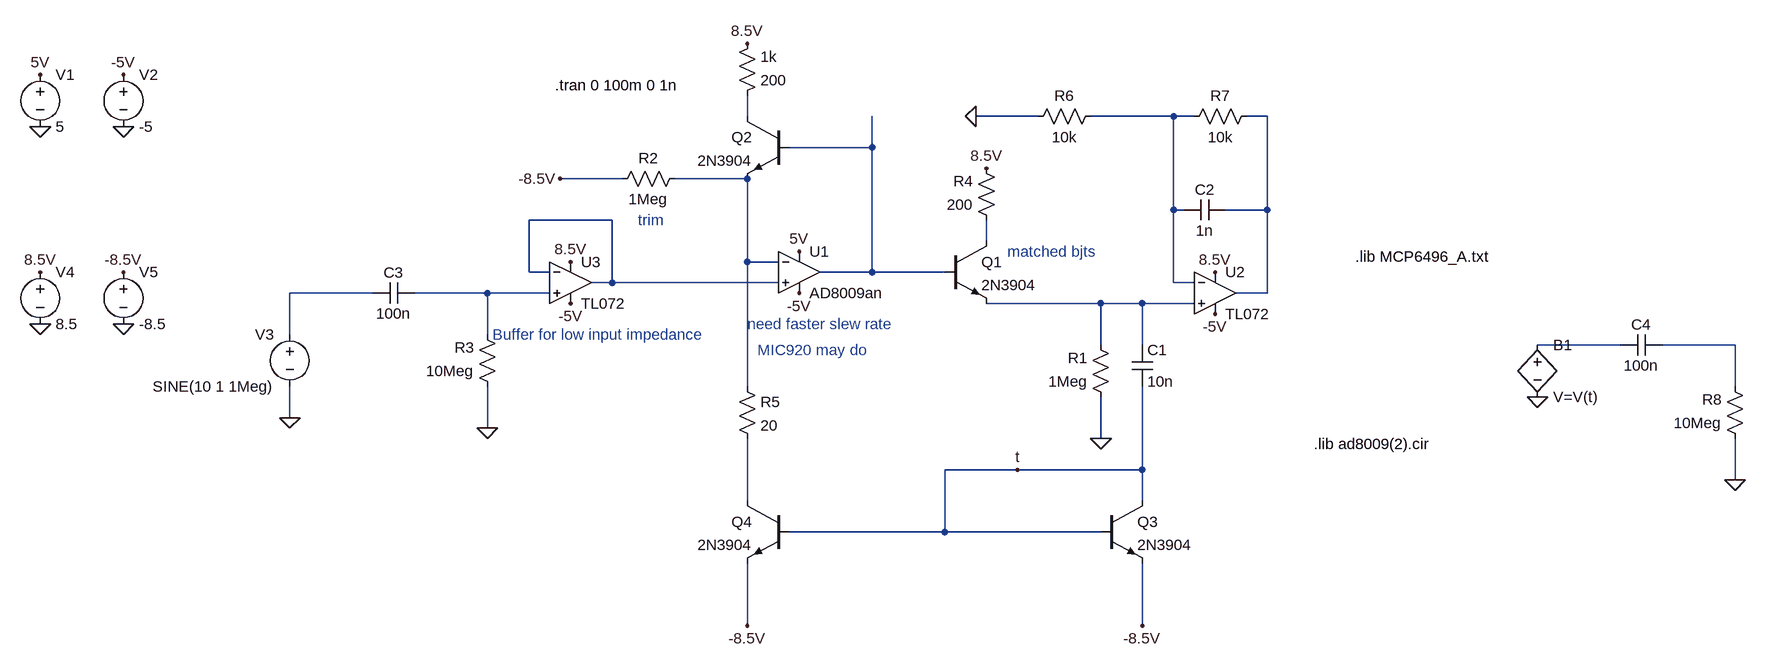
[diagram p0: schematic ogledalce.asc]
ogledalce.asc, the LTspice schematic file:
Version 4
SHEET 1 1620 924
WIRE 80 32 80 0
WIRE 528 32 432 32
WIRE 736 32 608 32
WIRE 768 32 736 32
WIRE 880 32 848 32
WIRE 272 80 272 32
WIRE 272 80 144 80
WIRE -112 128 -208 128
WIRE 80 128 -32 128
WIRE 736 176 736 32
WIRE 752 176 736 176
WIRE 880 176 880 32
WIRE 880 176 816 176
WIRE -128 192 -256 192
WIRE 448 224 448 192
WIRE 80 256 80 128
WIRE 128 256 80 256
WIRE -256 272 -256 192
WIRE -224 272 -256 272
WIRE 272 272 272 80
WIRE 272 272 192 272
WIRE 384 272 272 272
WIRE -128 288 -128 192
WIRE -128 288 -160 288
WIRE 128 288 -128 288
WIRE 736 288 736 176
WIRE 768 288 736 288
WIRE -496 304 -624 304
WIRE -320 304 -432 304
WIRE -224 304 -320 304
WIRE 880 304 880 176
WIRE 880 304 832 304
WIRE 624 320 448 320
WIRE 688 320 624 320
WIRE 768 320 688 320
WIRE -624 368 -624 304
WIRE -320 368 -320 304
WIRE 624 384 624 320
WIRE 688 384 688 320
WIRE 1424 384 1296 384
WIRE 1600 384 1488 384
WIRE 80 448 80 256
WIRE 1600 448 1600 384
WIRE -624 496 -624 448
WIRE -320 512 -320 448
WIRE 624 528 624 464
WIRE 496 576 384 576
WIRE 688 576 688 448
WIRE 688 576 496 576
WIRE 1600 592 1600 528
WIRE 80 624 80 528
WIRE 688 624 688 576
WIRE 384 672 384 576
WIRE 384 672 144 672
WIRE 624 672 384 672
WIRE 80 816 80 720
WIRE 688 816 688 720
FLAG -1008 48 0
FLAG 160 240 5V
FLAG -1008 -32 5V
FLAG -880 48 0
FLAG -880 -32 -5V
FLAG 160 304 -5V
FLAG 624 528 0
FLAG -624 496 0
FLAG 800 272 8.5V
FLAG 800 336 -5V
FLAG -1008 352 0
FLAG -1008 272 8.5V
FLAG -880 352 0
FLAG -880 272 -8.5V
FLAG 448 112 8.5V
FLAG 80 -80 8.5V
FLAG -208 128 -8.5V
FLAG 432 32 0
FLAG -320 512 0
FLAG -192 256 8.5V
FLAG -192 320 -5V
FLAG 80 816 -8.5V
FLAG 688 816 -8.5V
FLAG 496 576 t
FLAG 1600 592 0
FLAG 1296 464 0
SYMBOL voltage -1008 -48 R0
WINDOW 123 0 0 Left 0
WINDOW 39 0 0 Left 0
SYMATTR InstName V1
SYMATTR Value 5
SYMBOL voltage -880 -48 R0
WINDOW 123 0 0 Left 0
WINDOW 39 0 0 Left 0
SYMATTR InstName V2
SYMATTR Value -5
SYMBOL res 640 480 R180
WINDOW 0 36 76 Left 2
WINDOW 3 36 40 Left 2
SYMATTR InstName R1
SYMATTR Value 1Meg
SYMBOL cap 672 384 R0
SYMATTR InstName C1
SYMATTR Value 10n
SYMBOL voltage -624 352 M0
WINDOW 123 0 0 Left 0
WINDOW 39 0 0 Left 0
SYMATTR InstName V3
SYMATTR Value SINE(10 1 1Meg)
SYMBOL npn 384 224 R0
SYMATTR InstName Q1
SYMATTR Value 2N3904
SYMBOL voltage -1008 256 R0
WINDOW 123 0 0 Left 0
WINDOW 39 0 0 Left 0
SYMATTR InstName V4
SYMATTR Value 8.5
SYMBOL voltage -880 256 R0
WINDOW 123 0 0 Left 0
WINDOW 39 0 0 Left 0
SYMATTR InstName V5
SYMATTR Value -8.5
SYMBOL res 464 208 R180
WINDOW 0 36 76 Left 2
WINDOW 3 36 40 Left 2
SYMATTR InstName R4
SYMATTR Value 200
SYMBOL npn 144 32 M0
SYMATTR InstName Q2
SYMATTR Value 2N3904
SYMBOL res 64 16 M180
WINDOW 0 36 76 Left 2
WINDOW 3 36 40 Left 2
SYMATTR InstName 1k
SYMATTR Value 200
SYMBOL res -16 112 R90
WINDOW 0 0 56 VBottom 2
WINDOW 3 32 56 VTop 2
SYMATTR InstName R2
SYMATTR Value 1Meg
SYMBOL res 624 16 R90
WINDOW 0 0 56 VBottom 2
WINDOW 3 32 56 VTop 2
SYMATTR InstName R6
SYMATTR Value 10k
SYMBOL res 864 16 R90
WINDOW 0 0 56 VBottom 2
WINDOW 3 32 56 VTop 2
SYMATTR InstName R7
SYMATTR Value 10k
SYMBOL ZZZ\\OpAmp\\TL072 160 272 R0
SYMATTR InstName U1
SYMATTR Value AD8009an
SYMBOL ZZZ\\OpAmp\\TL072 800 304 R0
SYMATTR InstName U2
SYMBOL cap 816 160 R90
WINDOW 0 0 32 VBottom 2
WINDOW 3 32 32 VTop 2
SYMATTR InstName C2
SYMATTR Value 1n
SYMBOL cap -432 288 R90
WINDOW 0 0 32 VBottom 2
WINDOW 3 32 32 VTop 2
SYMATTR InstName C3
SYMATTR Value 100n
SYMBOL res -304 464 R180
WINDOW 0 36 76 Left 2
WINDOW 3 36 40 Left 2
SYMATTR InstName R3
SYMATTR Value 10Meg
SYMBOL ZZZ\\OpAmp\\TL072 -192 288 R0
SYMATTR InstName U3
SYMBOL npn 624 624 R0
SYMATTR InstName Q3
SYMATTR Value 2N3904
SYMBOL npn 144 624 M0
SYMATTR InstName Q4
SYMATTR Value 2N3904
SYMBOL res 64 432 R0
SYMATTR InstName R5
SYMATTR Value 20
SYMBOL bv 1296 368 R0
SYMATTR InstName B1
SYMATTR Value V=V(t)
SYMBOL cap 1488 368 R90
WINDOW 0 0 32 VBottom 2
WINDOW 3 32 32 VTop 2
SYMATTR InstName C4
SYMATTR Value 100n
SYMBOL res 1616 544 R180
WINDOW 0 36 76 Left 2
WINDOW 3 36 40 Left 2
SYMATTR InstName R8
SYMATTR Value 10Meg
TEXT -216 -16 Left 2 !.tran 0 100m 0 1n
TEXT 952 536 Left 2 !.lib ad8009(2).cir
TEXT 1016 248 Left 2 !.lib MCP6496_A.txt
TEXT 80 352 Left 2 ;need faster slew rate
TEXT -88 192 Left 2 ;trim
TEXT -312 368 Left 2 ;Buffer for low input impedance
TEXT 96 392 Left 2 ;MIC920 may do
TEXT 480 240 Left 2 ;matched bjts

The netlist it stands for:
* ogledalce.asc
V1 5V 0 5
V2 -5V 0 -5
R1 0 N010 1Meg
C1 N010 t 10n
V3 N008 0 SINE(10 1 1Meg)
Q1 N007 N004 N010 0 2N3904
V4 8.5V 0 8.5
V5 -8.5V 0 -8.5
R4 N007 8.5V 200
Q2 N001 N004 N005 0 2N3904
R§1k N001 8.5V 200
R2 N005 -8.5V 1Meg
R6 N002 0 10k
R7 N003 N002 10k
* U1: AD8009an (symbol ZZZ\OpAmp\TL072 not available, pins judged from their places): In+=N006 In-=N005 V+=5V V-=-5V OUT=N004
* U2: TL072 (symbol ZZZ\OpAmp\TL072 not available, pins judged from their places): In+=N010 In-=N002 V+=8.5V V-=-5V OUT=N003
C2 N003 N002 1n
C3 N009 N008 100n
R3 0 N009 10Meg
* U3: TL072 (symbol ZZZ\OpAmp\TL072 not available, pins judged from their places): In+=N009 In-=N006 V+=8.5V V-=-5V OUT=N006
Q3 t t -8.5V 0 2N3904
Q4 N013 t -8.5V 0 2N3904
R5 N005 N013 20
B1 N011 0 V=V(t)
C4 N012 N011 100n
R8 0 N012 10Meg
.model NPN NPN
.model PNP PNP
.lib standard.bjt
.tran 0 100m 0 1n
.lib ad8009(2).cir
.lib MCP6496_A.txt
* need faster slew rate
* trim
* Buffer for low input impedance
* MIC920 may do
* matched bjts
.backanno
.end